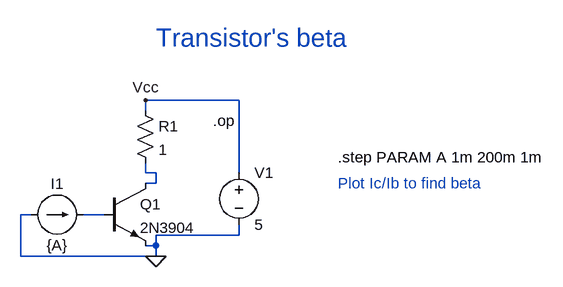
[diagram p0: schematic Transistor-beta.asc]
Transistor-beta.asc, the LTspice schematic file:
Version 4.1
SHEET 1 976 680
WIRE -16 144 -32 144
WIRE 160 192 176 192
WIRE 304 160 304 176
WIRE -32 144 -32 208
WIRE -32 208 176 208
WIRE 176 208 176 192
WIRE 176 192 176 176
WIRE 176 176 304 176
FLAG 176 208 0
WIRE 160 96 176 96
WIRE 160 64 160 80
WIRE 176 96 176 80
WIRE 176 80 160 80
WIRE 64 144 80 144
WIRE 96 144 80 144
WIRE 160 -16 160 -32
WIRE 304 80 304 64
WIRE 160 -32 304 -32
WIRE 304 -32 304 64
FLAG 160 -32 Vcc
SYMBOL current -16 144 R270
WINDOW 0 32 40 VTop 2
WINDOW 3 -32 40 VBottom 2
WINDOW 123 0 0 Left 2
WINDOW 39 0 0 Left 2
SYMATTR InstName I1
SYMATTR Value {A}
SYMBOL npn 96 96 R0
SYMATTR InstName Q1
SYMATTR Value 2N3904
SYMBOL voltage 304 64 R0
WINDOW 123 0 0 Left 2
WINDOW 39 0 0 Left 2
SYMATTR InstName V1
SYMATTR Value 5
SYMBOL res 144 -32 R0
SYMATTR InstName R1
SYMATTR Value 1
TEXT 456 56 Left 2 !.step PARAM A 1m 200m 1m
TEXT 264 0 Left 2 !.op
TEXT 456 96 Left 2 ;Plot Ic/Ib to find beta
TEXT 176 -128 Left 4 ;Transistor's beta

The netlist it stands for:
* Transistor-beta.asc
I1 0 N002 {A}
Q1 N001 N002 0 0 2N3904
V1 Vcc 0 5
R1 Vcc N001 1
.model NPN NPN
.model PNP PNP
.lib standard.bjt
.step PARAM A 1m 200m 1m
.op
* Plot Ic/Ib to find beta
* Transistor's beta
.backanno
.end